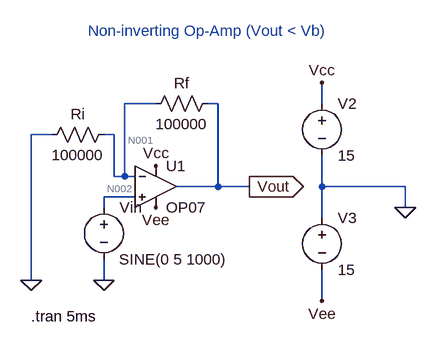
[diagram p0: schematic Assignment 6b (vi).asc]
Assignment 6b (vi).asc, the LTspice schematic file:
Version 4.1
SHEET 1 880 680
WIRE 16 64 -32 64
WIRE 112 64 96 64
WIRE 272 64 272 32
WIRE -144 112 -176 112
WIRE -48 112 -64 112
WIRE -48 176 -48 112
WIRE -32 176 -32 64
WIRE -32 176 -48 176
WIRE -16 176 -32 176
WIRE 112 192 112 64
WIRE 112 192 48 192
WIRE 160 192 112 192
WIRE 272 192 272 144
WIRE 400 192 272 192
WIRE -16 208 -64 208
WIRE -64 224 -64 208
WIRE 400 224 400 192
WIRE 272 240 272 192
WIRE -176 336 -176 112
WIRE -64 336 -64 304
WIRE 272 368 272 320
FLAG -176 336 0
FLAG -64 336 0
FLAG 400 224 0
FLAG 272 32 Vcc
FLAG 16 160 Vcc
FLAG 16 224 Vee
FLAG 272 368 Vee
FLAG 160 192 Vout
IOPIN 160 192 Out
SYMBOL voltage -64 208 R0
WINDOW 3 107 96 Center 2
WINDOW 123 0 0 Left 2
WINDOW 39 0 0 Left 2
SYMATTR Value SINE(0 5 1000)
SYMATTR InstName Vin
SYMBOL voltage 272 48 R0
WINDOW 123 0 0 Left 2
WINDOW 39 0 0 Left 2
SYMATTR InstName V2
SYMATTR Value 15
SYMBOL voltage 272 224 R0
WINDOW 123 0 0 Left 2
WINDOW 39 0 0 Left 2
SYMATTR InstName V3
SYMATTR Value 15
SYMBOL Opamps\\OP07 16 128 R0
SYMATTR InstName U1
SYMBOL res -48 96 R90
WINDOW 0 0 56 VBottom 2
WINDOW 3 32 56 VTop 2
SYMATTR InstName Ri
SYMATTR Value 100000
SYMBOL res 112 48 R90
WINDOW 0 0 56 VBottom 2
WINDOW 3 32 56 VTop 2
SYMATTR InstName Rf
SYMATTR Value 100000
TEXT -176 392 Left 2 !.tran 5ms
TEXT -88 -48 Left 2 ;Non-inverting Op-Amp (Vout < Vb)

The netlist it stands for:
* Assignment 6b (vi).asc
Vin N002 0 SINE(0 5 1000)
V2 Vcc 0 15
V3 0 Vee 15
X§U1 N002 N001 Vcc Vee Vout LT1001  ; OP07, pins In+ In- V+ V- OUT
Ri N001 0 100000
Rf Vout N001 100000
.tran 5ms
* Non-inverting Op-Amp (Vout < Vb)
.lib LTC.lib
.backanno
.end

* Results of the author's LTspice run, read from the files saved beside the schematic
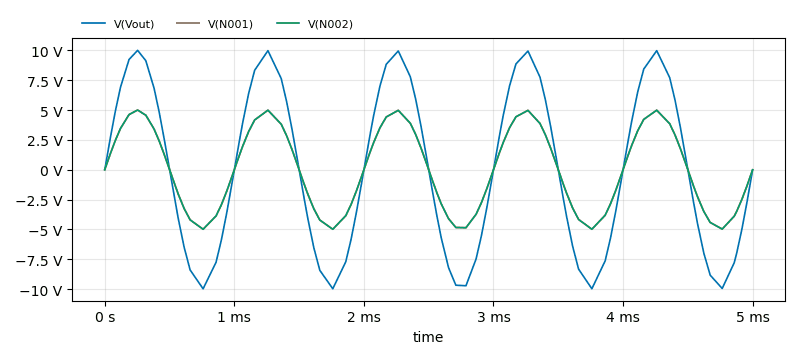
[diagram p1: Transient Analysis of Assignment 6b (vi).asc, plotted from the saved traces]
* Transient Analysis, 1 run:
*   V(Vout): min -9.976 V, max 9.998 V, average 3.469 mV, rms 6.957 V, last -20.85 mV
*   V(N001): min -4.988 V, max 4.999 V, average 1.735 mV, rms 3.479 V, last -11.99 mV
*   V(N002): min -4.987 V, max 4.999 V, average 1.734 mV, rms 3.479 V, last 0 V